# EAGLE schematic Adafruit Grand Central M4 Express rev B v7 (EAGLE 9.7.0)

## Sheet 1 of 2
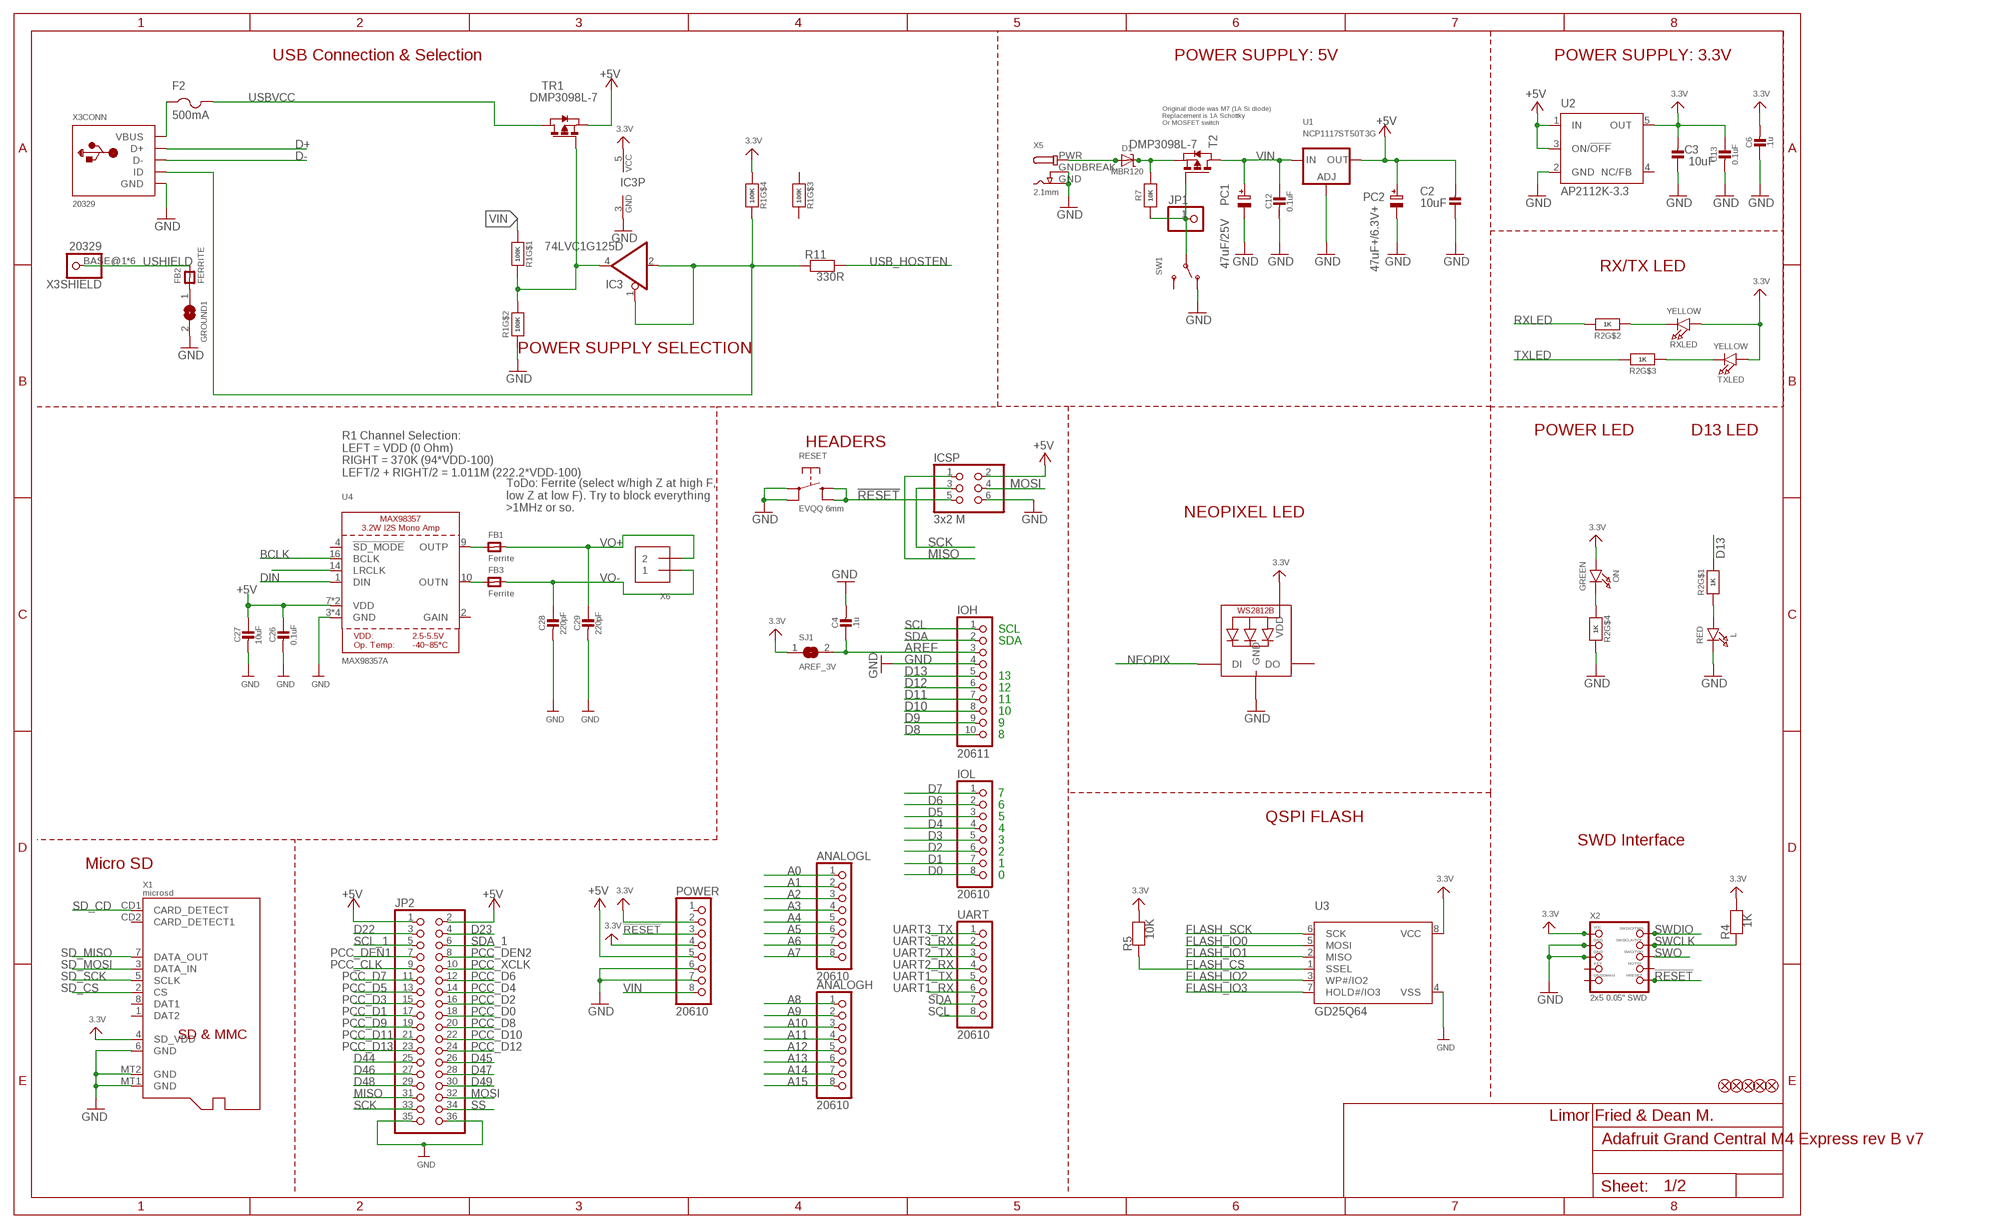
[diagram p0: schematic, sheet 1]

### Parts
ANALOGH  20610  HEADER-1X8OVALWAVE  [1X08_OVALWAVE]
ANALOGL  20610  HEADER-1X8OVALWAVE  [1X08_OVALWAVE]
C2  10uF  CAP_CERAMIC0805-NOOUTLINE  [0805-NO]
C3  10uF  CAP_CERAMIC0805-NOOUTLINE  [0805-NO]
C4  .1u  CAP_CERAMIC0603_NO  [0603-NO]
C6  .1u  CAP_CERAMIC0603_NO  [0603-NO]
C12  0.1uF  CAP_CERAMIC0603_NO  [0603-NO]
C13  0.1uF  CAP_CERAMIC0603_NO  [0603-NO]
C26  0.1uF  CAP_CERAMIC0805-NOOUTLINE  [0805-NO]
C27  10uF  CAP_CERAMIC0805-NOOUTLINE  [0805-NO]
C28  220pF  CAP_CERAMIC0805-NOOUTLINE  [0805-NO]
C29  220pF  CAP_CERAMIC0805-NOOUTLINE  [0805-NO]
D1  MBR120  DIODE-SCHOTTKYSOD-123  [SOD-123]
F2  500mA  PTCFUSE-1206  [R1206]
FB1  Ferrite  FERRITE-0805NO  [0805-NO]
FB2  FERRITE  FERRITE-0805NO  [0805-NO]
FB3  Ferrite  FERRITE-0805NO  [0805-NO]
FD1  FIDUCIAL_1MM  [FIDUCIAL_1MM]
FD2  FIDUCIAL_1MM  [FIDUCIAL_1MM]
FD3  FIDUCIAL_1MM  [FIDUCIAL_1MM]
FD4  FIDUCIAL_1MM  [FIDUCIAL_1MM]
FD5  FIDUCIAL_1MM  [FIDUCIAL_1MM]
GROUND1  SOLDERJUMPERCLOSED  [SOLDERJUMPER_CLOSEDWIRE]
IC3  74LVC1G125D  74AHC1G125DBV  [SOT23-5]
ICSP  3x2 M  HEADER-2X3  [2X03_ROUND_70MIL]
IOH  20611  HEADER-1X10OVALWAVE  [1X10_OVALWAVE]
IOL  20610  HEADER-1X8OVALWAVE  [1X08_OVALWAVE]
JP1  HEADER-1X1ROUND  [1X01_ROUND]
JP2  PINHD-2X18_THICKWAV  [2X18_THICKWAVE]
L  RED  LED0805_NOOUTLINE  [CHIPLED_0805_NOOUTLINE]
LED1  WS2812B3535  [LED3535]
ON  GREEN  LED0805_NOOUTLINE  [CHIPLED_0805_NOOUTLINE]
PC1  47uF/25V  CAP_ELECTROLYTICPANASONIC_D  [PANASONIC_D]
PC2  47uF+/6.3V+  CAP_ELECTROLYTICPANASONIC_D  [PANASONIC_D]
POWER  20610  HEADER-1X8OVALWAVE  [1X08_OVALWAVE]
R1  100K  RESISTOR_4PACK  [RESPACK_4X0603]
R2  1K  RESISTOR_4PACK  [RESPACK_4X0603]
R4  1K  RESISTOR_0603_NOOUT  [0603-NO]
R5  10K  RESISTOR_0603_NOOUT  [0603-NO]
R7  10K  RESISTOR_0603_NOOUT  [0603-NO]
R11  330R  RESISTOR_0603_NOOUT  [0603-NO]
RESET  EVQQ 6mm  SWITCH_TACT_SMT_EVQQ2_SMALL  [EVQ-Q2_SMALLER]
RXLED  YELLOW  LED0805_NOOUTLINE  [CHIPLED_0805_NOOUTLINE]
SJ1  AREF_3V  SOLDERJUMPERCLOSED  [SOLDERJUMPER_CLOSEDWIRE]
SW1  SWITCH_SPDT  [SPDT_SMT_SSSS811101]
T2  DMP3098L-7  PMOSSOT23  [SOT-23]
TR1  DMP3098L-7  0297_PMV48XP  [SOT-23]
TXLED  YELLOW  LED0805_NOOUTLINE  [CHIPLED_0805_NOOUTLINE]
U1  NCP1117ST50T3G  LM1117SOT223-REFLOW  [SOT223-R]
U2  AP2112K-3.3  LP2985-XXDBVR33  [SOT23-DBV]
U3  GD25Q64  SPIFLASH_SOIC8208MIL  [SOIC8_208MIL]
U4  MAX98357A  AUDIOAMP_MAX98357  [QFN16_3MM]
UART  20610  HEADER-1X8OVALWAVE  [1X08_OVALWAVE]
X1  microsd  MICROSD  [MICROSD]
X2  2x5 0.05" SWD  JTAG-CORTEXBOXPOSTS  [2X05_1.27MM_BOX_POSTS]
X3  20329  USB_W_SHIELD_V2  [4UCONN_20329_V2]
X5  2.1mm  DCBARRELPTH  [DCJACK_2MM_PTH]
X6  TERMBLOCK_1X2  [TERMBLOCK_1X2-3.5MM]

### Nets
3.3V: C3.2 C6.2 C13.1 IC3.5(VCC) LED1.2(VDD) ON.A POWER.2 POWER.4 R1.4 R4.2 R5.2 RXLED.A SJ1.1 TXLED.A U2.5(OUT) U3.8(VCC) X1.4(SD_VDD) X2.1(VCC) ; also sheet 2
!RESET: ICSP.5 POWER.3 RESET.B'(S1) RESET.B(S) X2.10(NRESET) ; also sheet 2
+5V [usbvcc]: C2.2 C26.1 C27.1 ICSP.2 JP2.1 JP2.2 PC2.+ POWER.5 TR1.2(S) U1.2(OUT) U1.4(OUT) U2.1(IN) U2.3(ON/!OFF) U4.7(VDD) U4.8(VDD)
A0: ANALOGL.1 ; also sheet 2
A1: ANALOGL.2 ; also sheet 2
A2: ANALOGL.3 ; also sheet 2
A3: ANALOGL.4 ; also sheet 2
A4: ANALOGL.5 ; also sheet 2
A5: ANALOGL.6 ; also sheet 2
A6: ANALOGL.7 ; also sheet 2
A7: ANALOGL.8 ; also sheet 2
A8: ANALOGH.1 ; also sheet 2
A9: ANALOGH.2 ; also sheet 2
A10: ANALOGH.3 ; also sheet 2
A11: ANALOGH.4 ; also sheet 2
A12: ANALOGH.5 ; also sheet 2
A13: ANALOGH.6 ; also sheet 2
A14: ANALOGH.7 ; also sheet 2
A15: ANALOGH.8 ; also sheet 2
AREF [aref]: C4.1 IOH.3 SJ1.2 ; also sheet 2
BCLK: U4.16(BCLK)
D0: IOL.8 ; also sheet 2
D1: IOL.7 ; also sheet 2
D2: IOL.6 ; also sheet 2
D3: IOL.5 ; also sheet 2
D4: IOL.4 ; also sheet 2
D5: IOL.3 ; also sheet 2
D6: IOL.2 ; also sheet 2
D7: IOL.1 ; also sheet 2
D8: IOH.10 ; also sheet 2
D9: IOH.9 ; also sheet 2
D10: IOH.8 ; also sheet 2
D11: IOH.7 ; also sheet 2
D12: IOH.6 ; also sheet 2
D13: IOH.5 R2.8 ; also sheet 2
D22: JP2.3 ; also sheet 2
D23: JP2.4 ; also sheet 2
D44: JP2.25 ; also sheet 2
D45: JP2.26 ; also sheet 2
D46: JP2.27 ; also sheet 2
D47: JP2.28 ; also sheet 2
D48: JP2.29 ; also sheet 2
D49: JP2.30 ; also sheet 2
D+ [USB]: X3.D+(CONN:D+) ; also sheet 2
D- [USB]: X3.D-(CONN:D-) ; also sheet 2
DIN: U4.1(DIN)
FLASH_CS: R5.1 U3.1(SSEL) ; also sheet 2
FLASH_IO0: U3.5(MOSI) ; also sheet 2
FLASH_IO1: U3.2(MISO) ; also sheet 2
FLASH_IO2: U3.3(WP#/IO2) ; also sheet 2
FLASH_IO3: U3.7(HOLD#/IO3) ; also sheet 2
FLASH_SCK: U3.6(SCK) ; also sheet 2
GND [gnd]: C2.1 C3.1 C4.2 C6.1 C12.2 C13.2 C26.2 C27.2 C28.2 C29.2 GROUND1.2 IC3.3(GND) ICSP.6 IOH.4 JP2.35 JP2.36 L.C LED1.4(GND) PC1.- PC2.- POWER.6 POWER.7 R1.2 R2.5 RESET.A'(P1) RESET.A(P) SW1.A(O) U1.1(ADJ) U2.2(GND) U3.4(VSS) U4.3(GND) U4.11(GND) U4.15(GND) U4.THERMAL(GND) X1.6(GND) X1.MT1(GND) X1.MT2(GND) X2.3(GND) X2.5(GND) X3.GND(CONN:GND) X5.GND X5.GNDBREAK ; also sheet 2
MISO: ICSP.1 JP2.31 ; also sheet 2
MOSI: ICSP.4 JP2.32 ; also sheet 2
N$1: L.A R2.1
N$2: FB2.1 GROUND1.1
N$3: ON.C R2.4
N$5: R2.2 RXLED.C
N$6: FB3.1 U4.10(OUTN)
N$7: R2.3 TXLED.C
N$8: FB1.1 U4.9(OUTP)
N$10: IC3.1(OE) IC3.2(I) R1.5 R11.1 X3.ID(CONN:ID)
N$11: IC3.4(O) R1.7 R1.8 TR1.3(G)
N$13: U4.14(LRCLK)
N$15: D1.C R7.2 T2.2(S)
NEOPIX: LED1.1(DI) ; also sheet 2
PCC_CLK: JP2.9 ; also sheet 2
PCC_D0: JP2.18 ; also sheet 2
PCC_D1: JP2.17 ; also sheet 2
PCC_D2: JP2.16 ; also sheet 2
PCC_D3: JP2.15 ; also sheet 2
PCC_D4: JP2.14 ; also sheet 2
PCC_D5: JP2.13 ; also sheet 2
PCC_D6: JP2.12 ; also sheet 2
PCC_D7: JP2.11 ; also sheet 2
PCC_D8: JP2.20 ; also sheet 2
PCC_D9: JP2.19 ; also sheet 2
PCC_D10: JP2.22 ; also sheet 2
PCC_D11: JP2.21 ; also sheet 2
PCC_D12: JP2.24 ; also sheet 2
PCC_D13: JP2.23 ; also sheet 2
PCC_DEN1: JP2.7 ; also sheet 2
PCC_DEN2: JP2.8 ; also sheet 2
PCC_XCLK: JP2.10 ; also sheet 2
PWR_SWITCH: JP1.1 R7.1 SW1.B(P) T2.3(G)
PWRIN [USB]: D1.A X5.PWR
RXLED: R2.7 ; also sheet 2
SCK: ICSP.3 JP2.33 ; also sheet 2
SCL: IOH.1 UART.8 ; also sheet 2
SCL_1: JP2.5 ; also sheet 2
SD_CD: X1.CD1(CARD_DETECT) ; also sheet 2
SD_CS: X1.2(CS) ; also sheet 2
SD_MISO: X1.7(DATA_OUT) ; also sheet 2
SD_MOSI: X1.3(DATA_IN) ; also sheet 2
SD_SCK: X1.5(SCLK) ; also sheet 2
SDA: IOH.2 UART.7 ; also sheet 2
SDA_1: JP2.6 ; also sheet 2
SS: JP2.34 ; also sheet 2
SWCLK: R4.1 X2.4(SWDCLK) ; also sheet 2
SWDIO: X2.2(SWDIO) ; also sheet 2
SWO: X2.6(SWO) ; also sheet 2
TXLED: R2.6 ; also sheet 2
UART1_RX: UART.6 ; also sheet 2
UART1_TX: UART.5 ; also sheet 2
UART2_RX: UART.4 ; also sheet 2
UART2_TX: UART.3 ; also sheet 2
UART3_RX: UART.2 ; also sheet 2
UART3_TX: UART.1 ; also sheet 2
USB_HOSTEN: R11.2 ; also sheet 2
USBVCC [usbvcc]: F2.2 TR1.1(D)
USHIELD [gnd]: FB2.2 X3.BASE@1 X3.BASE@2 X3.SPRT@1 X3.SPRT@2 X3.SPRT@3 X3.SPRT@4
VBUS: F2.1 X3.VBUS(CONN:VBUS)
VIN [USB]: C12.1 PC1.+ POWER.8 R1.1 T2.1(D) U1.3(IN)
VO+: C29.1 FB1.2 X6.2
VO-: C28.1 FB3.2 X6.1
Unconnected: LED1.3(DO) POWER.1 R1.3 R1.6 SW1.C(S) U2.4(NC/FB) U4.2(GAIN) U4.4(!SD_MODE) X1.1(DAT2) X1.8(DAT1) X1.CD2(CARD_DETECT1) X2.7(KEY) X2.8(TDI) X2.9(GNDDETECT)

### Notes on the sheet
- USB Connection & Selection | POWER SUPPLY: 5V | POWER SUPPLY: 3.3V
- Original diode was M7 (1A Si diode)
  Replacement is 1A Schottky
  Or MOSFET switch
- RX/TX LED
- POWER SUPPLY SELECTION
- POWER LED | D13 LED
- HEADERS
- R1 Channel Selection:
  LEFT = VDD (0 Ohm)
  RIGHT = 370K (94*VDD-100)
  LEFT/2 + RIGHT/2 = 1.011M (222.2*VDD-100)
- ToDo: Ferrite (select w/high Z at high F,
  low Z at low F). Try to block everything
  >1MHz or so.
- NEOPIXEL LED
- SCL
- SDA
- 13
- 12
- 11
- 10
- 9
- 8
- 7
- 6
- 5 | QSPI FLASH
- 4
- 3 | SWD Interface
- 2
- Micro SD | 1
- 0
- Limor Fried & Dean M.

## Sheet 2 of 2
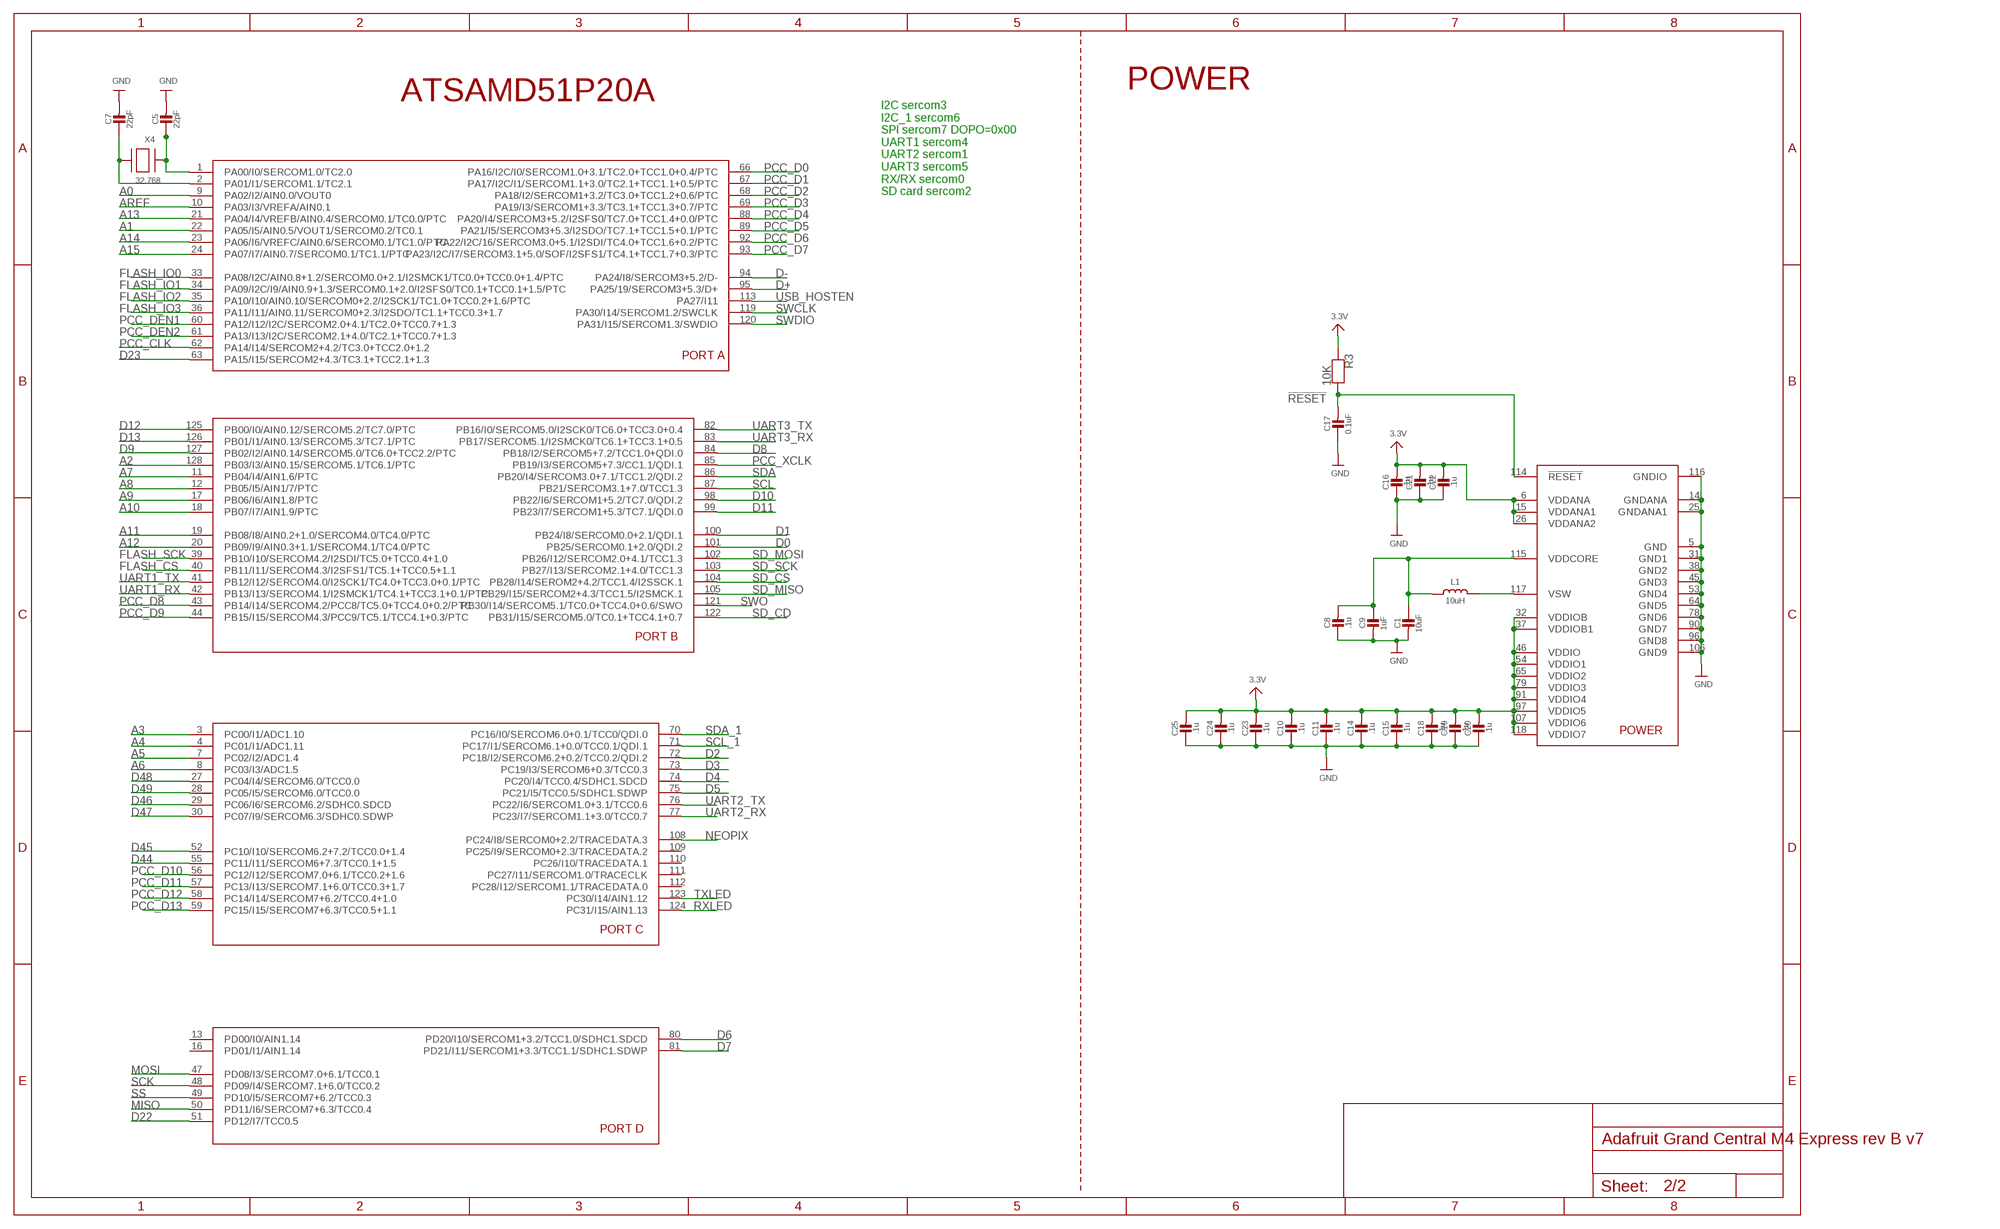
[diagram p1: schematic, sheet 2]

### Parts
C1  10uF  CAP_CERAMIC0805-NOOUTLINE  [0805-NO]
C5  22pF  CAP_CERAMIC0603_NO  [0603-NO]
C7  22pF  CAP_CERAMIC0603_NO  [0603-NO]
C8  .1u  CAP_CERAMIC0603_NO  [0603-NO]
C9  1uF  CAP_CERAMIC0603_NO  [0603-NO]
C10  .1u  CAP_CERAMIC0603_NO  [0603-NO]
C11  .1u  CAP_CERAMIC0603_NO  [0603-NO]
C14  .1u  CAP_CERAMIC0603_NO  [0603-NO]
C15  .1u  CAP_CERAMIC0603_NO  [0603-NO]
C16  .1u  CAP_CERAMIC0603_NO  [0603-NO]
C17  0.1uF  CAP_CERAMIC0603_NO  [0603-NO]
C18  .1u  CAP_CERAMIC0603_NO  [0603-NO]
C19  .1u  CAP_CERAMIC0603_NO  [0603-NO]
C20  .1u  CAP_CERAMIC0603_NO  [0603-NO]
C21  .1u  CAP_CERAMIC0603_NO  [0603-NO]
C22  .1u  CAP_CERAMIC0603_NO  [0603-NO]
C23  .1u  CAP_CERAMIC0603_NO  [0603-NO]
C24  .1u  CAP_CERAMIC0603_NO  [0603-NO]
C25  .1u  CAP_CERAMIC0603_NO  [0603-NO]
L1  10uH  INDUCTOR  [INDUCTOR_1007]
R3  10K  RESISTOR_0603_NOOUT  [0603-NO]
U$1  SAMD51PXXA  [SQFP-S-14X14-128]
X4  32.768  XTAL-3.2X1.5  [XTAL3215]

### Nets
3.3V: C10.2 C11.2 C14.2 C15.2 C16.2 C18.2 C19.2 C20.2 C21.2 C22.2 C23.2 C24.2 C25.2 R3.1 U$1.6(VDDANA) U$1.15(VDDANA1) U$1.26(VDDANA2) U$1.32(VDDIOB) U$1.37(VDDIOB1) U$1.46(VDDIO) U$1.54(VDDIO1) U$1.65(VDDIO2) U$1.79(VDDIO3) U$1.91(VDDIO4) U$1.97(VDDIO5) U$1.107(VDDIO6) U$1.118(VDDIO7) ; also sheet 1
!RESET: C17.2 R3.2 U$1.114(!RESET) ; also sheet 1
A0: U$1.9(PA02/I2/AIN0.0/VOUT0) ; also sheet 1
A1: U$1.22(PA05/I5/AIN0.5/VOUT1/SERCOM0.2/TC0.1) ; also sheet 1
A2: U$1.128(PB03/I3/AIN0.15/SERCOM5.1/TC6.1/PTC) ; also sheet 1
A3: U$1.3(PC00/I1/ADC1.10) ; also sheet 1
A4: U$1.4(PC01/I1/ADC1.11) ; also sheet 1
A5: U$1.7(PC02/I2/ADC1.4) ; also sheet 1
A6: U$1.8(PC03/I3/ADC1.5) ; also sheet 1
A7: U$1.11(PB04/I4/AIN1.6/PTC) ; also sheet 1
A8: U$1.12(PB05/I5/AIN1/7/PTC) ; also sheet 1
A9: U$1.17(PB06/I6/AIN1.8/PTC) ; also sheet 1
A10: U$1.18(PB07/I7/AIN1.9/PTC) ; also sheet 1
A11: U$1.19(PB08/I8/AIN0.2+1.0/SERCOM4.0/TC4.0/PTC) ; also sheet 1
A12: U$1.20(PB09/I9/AIN0.3+1.1/SERCOM4.1/TC4.0/PTC) ; also sheet 1
A13: U$1.21(PA04/I4/VREFB/AIN0.4/SERCOM0.1/TC0.0/PTC) ; also sheet 1
A14: U$1.23(PA06/I6/VREFC/AIN0.6/SERCOM0.1/TC1.0/PTC) ; also sheet 1
A15: U$1.24(PA07/I7/AIN0.7/SERCOM0.1/TC1.1/PTC) ; also sheet 1
AREF [aref]: U$1.10(PA03/I3/VREFA/AIN0.1) ; also sheet 1
D0: U$1.101(PB25/SERCOM0.1+2.0/QDI.2) ; also sheet 1
D1: U$1.100(PB24/I8/SERCOM0.0+2.1/QDI.1) ; also sheet 1
D2: U$1.72(PC18/I2/SERCOM6.2+0.2/TCC0.2/QDI.2) ; also sheet 1
D3: U$1.73(PC19/I3/SERCOM6+0.3/TCC0.3) ; also sheet 1
D4: U$1.74(PC20/I4/TCC0.4/SDHC1.SDCD) ; also sheet 1
D5: U$1.75(PC21/I5/TCC0.5/SDHC1.SDWP) ; also sheet 1
D6: U$1.80(PD20/I10/SERCOM1+3.2/TCC1.0/SDHC1.SDCD) ; also sheet 1
D7: U$1.81(PD21/I11/SERCOM1+3.3/TCC1.1/SDHC1.SDWP) ; also sheet 1
D8: U$1.84(PB18/I2/SERCOM5+7.2/TCC1.0+QDI.0) ; also sheet 1
D9: U$1.127(PB02/I2/AIN0.14/SERCOM5.0/TC6.0+TCC2.2/PTC) ; also sheet 1
D10: U$1.98(PB22/I6/SERCOM1+5.2/TC7.0/QDI.2) ; also sheet 1
D11: U$1.99(PB23/I7/SERCOM1+5.3/TC7.1/QDI.0) ; also sheet 1
D12: U$1.125(PB00/I0/AIN0.12/SERCOM5.2/TC7.0/PTC) ; also sheet 1
D13: U$1.126(PB01/I1/AIN0.13/SERCOM5.3/TC7.1/PTC) ; also sheet 1
D22: U$1.51(PD12/I7/TCC0.5) ; also sheet 1
D23: U$1.63(PA15/I15/SERCOM2+4.3/TC3.1+TCC2.1+1.3) ; also sheet 1
D44: U$1.55(PC11/I11/SERCOM6+7.3/TCC0.1+1.5) ; also sheet 1
D45: U$1.52(PC10/I10/SERCOM6.2+7.2/TCC0.0+1.4) ; also sheet 1
D46: U$1.29(PC06/I6/SERCOM6.2/SDHC0.SDCD) ; also sheet 1
D47: U$1.30(PC07/I9/SERCOM6.3/SDHC0.SDWP) ; also sheet 1
D48: U$1.27(PC04/I4/SERCOM6.0/TCC0.0) ; also sheet 1
D49: U$1.28(PC05/I5/SERCOM6.0/TCC0.0) ; also sheet 1
D+ [USB]: U$1.95(PA25/19/SERCOM3+5.3/D+) ; also sheet 1
D- [USB]: U$1.94(PA24/I8/SERCOM3+5.2/D-) ; also sheet 1
FLASH_CS: U$1.40(PB11/I11/SERCOM4.3/I2SFS1/TC5.1+TCC0.5+1.1) ; also sheet 1
FLASH_IO0: U$1.33(PA08/I2C/AIN0.8+1.2/SERCOM0.0+2.1/I2SMCK1/TC0.0+TCC0.0+1.4/PTC) ; also sheet 1
FLASH_IO1: U$1.34(PA09/I2C/I9/AIN0.9+1.3/SERCOM0.1+2.0/I2SFS0/TC0.1+TCC0.1+1.5/PTC) ; also sheet 1
FLASH_IO2: U$1.35(PA10/I10/AIN0.10/SERCOM0+2.2/I2SCK1/TC1.0+TCC0.2+1.6/PTC) ; also sheet 1
FLASH_IO3: U$1.36(PA11/I11/AIN0.11/SERCOM0+2.3/I2SDO/TC1.1+TCC0.3+1.7) ; also sheet 1
FLASH_SCK: U$1.39(PB10/I10/SERCOM4.2/I2SDI/TC5.0+TCC0.4+1.0) ; also sheet 1
GND [gnd]: C1.2 C5.2 C7.2 C8.1 C9.2 C10.1 C11.1 C14.1 C15.1 C16.1 C17.1 C18.1 C19.1 C20.1 C21.1 C22.1 C23.1 C24.1 C25.1 U$1.5(GND) U$1.14(GNDANA) U$1.25(GNDANA1) U$1.31(GND1) U$1.38(GND2) U$1.45(GND3) U$1.53(GND4) U$1.64(GND5) U$1.78(GND6) U$1.90(GND7) U$1.96(GND8) U$1.106(GND9) U$1.116(GNDIO) ; also sheet 1
MISO: U$1.50(PD11/I6/SERCOM7+6.3/TCC0.4) ; also sheet 1
MOSI: U$1.47(PD08/I3/SERCOM7.0+6.1/TCC0.1) ; also sheet 1
N$4: L1.P$2 U$1.117(VSW)
N$9: C5.1 U$1.1(PA00/I0/SERCOM1.0/TC2.0) X4.P$1
N$12: C7.1 U$1.2(PA01/I1/SERCOM1.1/TC2.1) X4.P$2
NEOPIX: U$1.108(PC24/I8/SERCOM0+2.2/TRACEDATA.3) ; also sheet 1
PCC_CLK: U$1.62(PA14/I14/SERCOM2+4.2/TC3.0+TCC2.0+1.2) ; also sheet 1
PCC_D0: U$1.66(PA16/I2C/I0/SERCOM1.0+3.1/TC2.0+TCC1.0+0.4/PTC) ; also sheet 1
PCC_D1: U$1.67(PA17/I2C/I1/SERCOM1.1+3.0/TC2.1+TCC1.1+0.5/PTC) ; also sheet 1
PCC_D2: U$1.68(PA18/I2/SERCOM1+3.2/TC3.0+TCC1.2+0.6/PTC) ; also sheet 1
PCC_D3: U$1.69(PA19/I3/SERCOM1+3.3/TC3.1+TCC1.3+0.7/PTC) ; also sheet 1
PCC_D4: U$1.88(PA20/I4/SERCOM3+5.2/I2SFS0/TC7.0+TCC1.4+0.0/PTC) ; also sheet 1
PCC_D5: U$1.89(PA21/I5/SERCOM3+5.3/I2SDO/TC7.1+TCC1.5+0.1/PTC) ; also sheet 1
PCC_D6: U$1.92(PA22/I2C/16/SERCOM3.0+5.1/I2SDI/TC4.0+TCC1.6+0.2/PTC) ; also sheet 1
PCC_D7: U$1.93(PA23/I2C/I7/SERCOM3.1+5.0/SOF/I2SFS1/TC4.1+TCC1.7+0.3/PTC) ; also sheet 1
PCC_D8: U$1.43(PB14/I14/SERCOM4.2/PCC8/TC5.0+TCC4.0+0.2/PTC) ; also sheet 1
PCC_D9: U$1.44(PB15/I15/SERCOM4.3/PCC9/TC5.1/TCC4.1+0.3/PTC) ; also sheet 1
PCC_D10: U$1.56(PC12/I12/SERCOM7.0+6.1/TCC0.2+1.6) ; also sheet 1
PCC_D11: U$1.57(PC13/I13/SERCOM7.1+6.0/TCC0.3+1.7) ; also sheet 1
PCC_D12: U$1.58(PC14/I14/SERCOM7+6.2/TCC0.4+1.0) ; also sheet 1
PCC_D13: U$1.59(PC15/I15/SERCOM7+6.3/TCC0.5+1.1) ; also sheet 1
PCC_DEN1: U$1.60(PA12/I12/I2C/SERCOM2.0+4.1/TC2.0+TCC0.7+1.3) ; also sheet 1
PCC_DEN2: U$1.61(PA13/I13/I2C/SERCOM2.1+4.0/TC2.1+TCC0.7+1.3) ; also sheet 1
PCC_XCLK: U$1.85(PB19/I3/SERCOM5+7.3/CC1.1/QDI.1) ; also sheet 1
RXLED: U$1.124(PC31/I15/AIN1.13) ; also sheet 1
SCK: U$1.48(PD09/I4/SERCOM7.1+6.0/TCC0.2) ; also sheet 1
SCL: U$1.87(PB21/SERCOM3.1+7.0/TCC1.3) ; also sheet 1
SCL_1: U$1.71(PC17/I1/SERCOM6.1+0.0/TCC0.1/QDI.1) ; also sheet 1
SD_CD: U$1.122(PB31/I15/SERCOM5.0/TC0.1+TCC4.1+0.7) ; also sheet 1
SD_CS: U$1.104(PB28/I14/SEROM2+4.2/TCC1.4/I2SSCK.1) ; also sheet 1
SD_MISO: U$1.105(PB29/I15/SERCOM2+4.3/TCC1.5/I2SMCK.1) ; also sheet 1
SD_MOSI: U$1.102(PB26/I12/SERCOM2.0+4.1/TCC1.3) ; also sheet 1
SD_SCK: U$1.103(PB27/I13/SERCOM2.1+4.0/TCC1.3) ; also sheet 1
SDA: U$1.86(PB20/I4/SERCOM3.0+7.1/TCC1.2/QDI.2) ; also sheet 1
SDA_1: U$1.70(PC16/I0/SERCOM6.0+0.1/TCC0/QDI.0) ; also sheet 1
SS: U$1.49(PD10/I5/SERCOM7+6.2/TCC0.3) ; also sheet 1
SWCLK: U$1.119(PA30/I14/SERCOM1.2/SWCLK) ; also sheet 1
SWDIO: U$1.120(PA31/I15/SERCOM1.3/SWDIO) ; also sheet 1
SWO: U$1.121(PB30/I14/SERCOM5.1/TC0.0+TCC4.0+0.6/SWO) ; also sheet 1
TXLED: U$1.123(PC30/I14/AIN1.12) ; also sheet 1
UART1_RX: U$1.42(PB13/I13/SERCOM4.1/I2SMCK1/TC4.1+TCC3.1+0.1/PTC) ; also sheet 1
UART1_TX: U$1.41(PB12/I12/SERCOM4.0/I2SCK1/TC4.0+TCC3.0+0.1/PTC) ; also sheet 1
UART2_RX: U$1.77(PC23/I7/SERCOM1.1+3.0/TCC0.7) ; also sheet 1
UART2_TX: U$1.76(PC22/I6/SERCOM1.0+3.1/TCC0.6) ; also sheet 1
UART3_RX: U$1.83(PB17/SERCOM5.1/I2SMCK0/TC6.1+TCC3.1+0.5) ; also sheet 1
UART3_TX: U$1.82(PB16/I0/SERCOM5.0/I2SCK0/TC6.0+TCC3.0+0.4) ; also sheet 1
USB_HOSTEN: U$1.113(PA27/I11) ; also sheet 1
VDDCORE: C1.1 C8.2 C9.1 L1.P$1 U$1.115(VDDCORE)
Unconnected: U$1.13(PD00/I0/AIN1.14) U$1.16(PD01/I1/AIN1.14) U$1.109(PC25/I9/SERCOM0+2.3/TRACEDATA.2) U$1.110(PC26/I10/TRACEDATA.1) U$1.111(PC27/I11/SERCOM1.0/TRACECLK) U$1.112(PC28/I12/SERCOM1.1/TRACEDATA.0)

### Notes on the sheet
- POWER
- ATSAMD51P20A
- I2C sercom3
  I2C_1 sercom6
  SPI sercom7 DOPO=0x00
  UART1 sercom4
  UART2 sercom1
  UART3 sercom5
  RX/RX sercom0
  SD card sercom2

## Library data of the parts
ANALOGH ANALOGL IOL POWER UART = microbuilder:HEADER-1X8: PIN HEADER
C1-C29 = microbuilder:CAP_CERAMIC: Ceramic Capacitors For new designs, use the packages preceded by an '_' character since they are more reliable: The following footprints should be used on most boards: _0402 - Standard footprint for regular board layouts _0603 - Standard footprint for regular board layouts _0805 - Standard footprint for regular board layouts _1206 - Standard footprint for regular board layouts For extremely tight-pitch boards where space is at a premium, the following 'micro-pitch' footprints can be used (smaller pads, no silkscreen outline, etc.): _0402MP - Micro-pitch footprint for very dense/compact boards _0603MP - Micro-pitch footprint for very dense/compact boards _0805MP - Micro-pitch footprint for very dense/compact boards _1206MP - Micro-pitch footprint for very dense/compact boards
D1 = microbuilder:DIODE-SCHOTTKY
F2 = adafruit:PTCFUSE: PTC fuses, resettable thermistors
FB1-FB3 = microbuilder:FERRITE: Ferrite Bead 0603 MMZ1608B121C - 120 Ohm @ 100MHz, 600mA, 0.15 Ohm DC Resistance - Digikey: 445-2164-1-ND BK1608HW121-T - 120 Ohm, 600mA Ferrite Chip - Digikey: 587-1876-2-ND 0805 HZ0805B272R-10 - 2.7K Ohm @ 100MHz, 200mA, 0.8 Ohm DC Resistance - Digikey: 240-2504-1-ND (see also Murata BLM21BD272SN1L) MMZ2012Y152B - 1.5K Ohm @ 100MHz, 500mA, 0.4 Ohm DC Resistance - Digikey: 445-1560-1-ND - Mainly for high frequency (80-400MHz) MMZ2012R102A - 1K Ohm @ 100MHz, 500mA, 0.3 Ohm DC Resistance - Digikey: 445-1555-2-ND - More general purpose (10-200MHz)
FD1-FD5 = microbuilder:FIDUCIAL: Fiducial Alignment Points Various fiducial points for machine vision alignment.; BOM: EXCLUDE
GROUND1 SJ1 = microbuilder:SOLDERJUMPER: SMD Solder JUMPER Solder the two pads together to create a connection, or remove the solder to break it. REFLOW - Use this footprint for solder paste and reflow ovens. WAVE - Use this footprint for hand-soldering (larger pads). CLOSED - Has a trace between the two pads to ensure it is closed by default. The trace needs to be cut to disable the jumper, and can be closed again by creating a solder bridge between the two pads.
IC3 = 74xx-little-de:74*1G125: Single Bus Buffer Gate with 3-State Output
ICSP = microbuilder:HEADER-2X3: PIN HEADER
IOH = microbuilder:HEADER-1X10: PIN HEADER
JP1 = microbuilder:HEADER-1X1: PIN HEADER
JP2 = microbuilder:PINHD-2X18: PIN HEADER
L ON RXLED TXLED = microbuilder:LED: LED 0603 - 0603 Surface Mount Package 2mA: Green LED - Low Power (3.9mcd, 2ma, 1.7Vf) - Digikey: 475-2709-2-ND Orange LED - Low Power (9.8mcd, 2ma, 1.8Vf) - Digikey: 475-1194-2-ND Red LED - Low Power (5mcd, 2ma, 1.8Vf) - Digikey: 475-1195-2-ND Yellow LED - Low Power (7mcd, 2ma, 1.8Vf) - Digikey: 475-1196-2-ND 5mA: Blue LED - Low Power (17mcd, 5ma, 2.9Vf) - Digikey: LNJ937W8CRACT-ND 0805 - 0805 Surface Mount Package 2mA: Red LED (8.8mcd, 2mA, 1.8Vf, Clear) - Low Power [Digikey: 475-2510-1-ND] Green LED (5mcd, 2mA, 1.8Vf, Clear) - Low Power [Digikey: 475-2730-1-ND] Yellow LED (11.3mcd, 2mA, 1.8Vf, Clear) - Low Power [Digikey: 475-2555-1-ND] 20mA: Red LED (104mcd, 20mA, Diffused) - LS R976 [Digikey: 475-1278-6-ND] Red LED (12mcd, 20mA, 2.0Vf, Clear) - APT2012EC [Digikey: 754-1128-1-ND] Green LED (15mcd, 20mA, 2.2Vf, Clear) - APT2012GC [Digikey: 754-1131-1-ND] Orange LED (160mcd, 20mA, 2.1Vf, Clear) - APT2012SECK [Digikey: 754-1130-1-ND] 1206 - 1206 Surface Mount Package Green LED (26mcd, 20mA, Diffused) - LG N971 [Digikey: 475-1407-6-ND] Red LED (15mcd, 20mA, Diffused) - LH N974 [Digikey: 475-1416-6-ND] Cree - Cree High-Power Surface Mount LEDs XPEBWT-L1-0000-00D50 - White 111lm 350mA 2.9Vf 6200K 110° XTEAWT-00-0000-00000LEE3 - White 114lm 350mA 2.85Vf 5000K 115° Everlight - Everlight 45-21 Series Surface Mount LEDs 45-21/QK2C-B2832AC2CB2/2T - Warm White 2000mcd 20mA 3.25Vf 3050K 120° 45-21/LK2C-B38452C4CB2/2T - Nuetral White 2000mcd 20mA 3.25Vf 4150K 120° 45-21/LK2C-B50634C6CB2/2T - Cold White 2200mcd 20mA 3.25Vf 5650K 120° PLCC2 Reverse Mount LS T77K-J1L2-1-0-2-R18-Z - Red 11.25mcd 2mA 1.8Vf 630nm 120° LO T77K-L1M2-24-Z - Orange 19.6mcd 2mA 1.8Vf 606nm 120° LY T77K-K2M1-26-Z - Yellow 15.7mcd 2mA 1.8Vf 587nm 120°
L1 = microbuilder:INDUCTOR: Inductors 0603: 10nH Ceramic Inductor - microwire antenna/RF (Digikey: 712-1434-2-ND) 0805: 560nH Ceramic Inductor - RF (Digikey: 553-1047-1-ND) 270nH Ceramic Inductor - Q = 40@250MHz, +-5%, 1 Ohm DC Resistance (Digikey: 535-10506-2-ND) 1007 (2518 Metric) SMT: 10µH 10% 250mOhm 820mA 1007 Inductor (Digikey: 587-2189-1-ND) 22µH 10% 500mOhm 580mA 1007 Inductor (Digikey: 587-2190-1-ND) 47µH 10% 950mOhm 420mA 1007 Inductor (Digikey: 587-2191-1-ND) 47µH 5% 100mOhm 1A 1008 Inductor (Digikey: 732-1816-1-ND) 5.0x5.0mm (Taiyo Yuden NR5040 Series) 6.8µH 20% 2.3A 64mOhm Inductor (Digikey: 587-2374-2-ND) 5.0x5.0mm (TDK VLC5045 Series) 4.7µH 20% 3.3A 34mOhm Inductor (Digikey: 445-6526-1-ND) 6.8µH 20% 2.7A 46mOhm Inductor (Digikey: 445-6527-1-ND) 6.0x6.0mm (TDK VLC6045 Series) 4.7µH 20% 3.8A 27mOhm Inductor (Digikey: 445-6538-2-ND) 6.8µH 20% 3A 41mOhm Inductor (Digikey: 445-6540-1-ND) 6.2µH 30% 2.2A 45mOhm Inductor (Digikey: SRR5028-6R2YCT-ND) - Not TDK VLC6045 but footprint should match 6.0x6.0mm (TDK SLF6045 Series) 6.8uH 30% 2A 33mOhm Inductor (Digikey: 445-4572-1-ND, Mouser: 810-SLF645T6R8N2R0PF) 6.0x6.0mm (Sumida CDRH5D28 Series) 6.2uH 30% 1.8A 45mOhm Inductor (Digikey: 308-1542-1-ND) Taiyo Yuden NR3015T2R2M - 2.2uH 20% 1.5A (Digikey: 587-1648-2-ND, Mouser: 963-NR3015T2R2M) - Used with TI TPS62172 CoilCraft RFID Transponder Coil - MA5532-AE (For use with AS3935 Lightning Sensor) Taiyo Yuden NRH2412T2R2MNGH - 2.2uH 20% 1AA (Digikey: 587-3443-1-ND) - Used with TI LM3671 Vishay IHLP 1.0uH Molded Inductor - 24mOhm DCR, 5A, +/-20%, -55°C-125°C (Digikey: 541-1319-1-ND)
LED1 = microbuilder:WS2812B
PC1 PC2 = microbuilder:CAP_ELECTROLYTIC: Electrolytic Capacitors SMT PANASONIC_C - Size C Panasonic Electrolytic Aluminum Capacitor 47µF 16V 20% Electrolytic Capacitor [Digikey: PCE3890TR-ND] PANASONIC_D - Size D Panasonic Electrolytic Aluminum Capacitor 100µF 25V 20% Electrolytic Capacitor [Digikey: PCE3898TR-ND] PTH 3.5 mm grid, 8 mm diameter ... 3.5 mm grid, 10 mm diameter ...
R1 R2 = microbuilder:RESISTOR_4PACK: Resistor Packs (4 resistors) 4 x 0603 10K 1/16W - Digikey: YC164J-10KCT-ND
R3-R5 R7 R11 = microbuilder:RESISTOR: Resistors For new designs, use the packages preceded by an '_' character since they are more reliable: The following footprints should be used on most boards: _0402 - Standard footprint for regular board layouts _0603 - Standard footprint for regular board layouts _0805 - Standard footprint for regular board layouts _1206 - Standard footprint for regular board layouts For extremely tight-pitch boards where space is at a premium, the following 'micro-pitch' footprints can be used (smaller pads, no silkscreen outline, etc.): _0402MP - Micro-pitch footprint for very dense/compact boards _0603MP - Micro-pitch footprint for very dense/compact boards _0805MP - Micro-pitch footprint for very dense/compact boards _1206MP - Micro-pitch footprint for very dense/compact boards
RESET = microbuilder:SWITCH_TACT_SMT: SMT Tact Switches 6x6mm - Digikey: P12940SCT-ND KMR2 (4.6x2.8mm) - Digikey: 401-1426-1-ND EVQ-PQHB55 - Light Touch, 160GF (4.5x4.5mm) - Digikey: P8090SCT-ND KMT0 - KMT021 NGJ LHS (etc.) IP68/Waterproof - Digikey: CKN10289CT-ND
SW1 = microbuilder:SWITCH_SPDT: Switch - SPDT SSSS811101 - Horizontal Two Position SMT, 0.3A 4V [Mouser: 688-SSSS811101]
T2 = zetex:PMOSSOT23: MOS FET; OC_FARNELL: unknown; OC_NEWARK: unknown
TR1 = Transistors:0297_PMV48XP: 20 V, 3.5 A P-channel Trench MOSFET - PMV48XP; CASE: SOT23; MONTHLY_USAGE: _____; PART_NUMBER: PMV48XP; PRICE: _____; SUPPLIER: _____; TYPE: Transistor; VALUE: PMV48XP
U1 = microbuilder:LM1117: LM1117 Voltage Regulator LM1117 Adjustable Voltage regulator [Digikey: LM1117IMP-ADJDKR-ND] LM1117 3.3V Voltage regulator [AP1117E33GDIDKR-ND] LM1117 5.0V Voltage regulator [AP1117E50GDIDKR-ND] SOT223-REFLOW - SOT223 package for solder paste/reflow ovens SOT223-WAVE - SOT223 package for hand-soldering (larger pads) Note: For the fixed-voltage regulators, simply set the ADJ pin to GND.
U2 = SmartPrj:LP2985-XXDBVR: ULTRALOW-POWER 50-mA LOW-DROPOUT LINEAR REGULATORS 50-mA Low-Dropout Regulator Source: http://focus.ti.com/lit/ds/symlink/tps77001.pdf
U3 = microbuilder:SPIFLASH_SOIC8: SOIC8 SPI Flash Be careful with the size since SOIC8 flash comes in several 'widths' SOIC8 150 mil M25P16 - 16Mbit (2Mbit x 8) Serial Flash (75MHz SPI Bus), Supply: 2.7-3.6V Digikey: SOIC8 - M25P16-VMN6P-ND SOIC8 208 mil W25Q16BVSSIG - 16Mbit (2Mbit x 8) Serial Flash (104MHz SPI Bus), Supply: 2.7-3.6V Digikey: SOIC8 - W25Q16BVSSIG-ND
U4 = microbuilder:AUDIOAMP_MAX98357: MAX98357 - 3.2W I2S Mono Audio Amp
U$1 = microbuilder:SAMD51PXXA: SAMD51 P variant
X1 = microbuilder:MICROSD: MicroSD/Transflash Card Holder with SPI pinout 3M: 2908-05WB-MG 4UConnector: 19656 Footprint courtesy: Adafruit Industries
X2 = microbuilder:JTAG-CORTEX: Serial Wire (SW-DP) Connector Standard 0.05" 10-pin connector is for use with the Cortex M and Cortex A SWD (serial wire debugger) interface (SW-DP) Connectors 2x05_1.27MM_SMT - Inexpensive surface-mount header with bare pins, compatible with standard 10-pin SWD cables (4UCON: 16846) 2x05_1.27MM_BOX_NOPOSTS - Polarised surface-mount box (4UCON with caps: 19735, without caps: 15117 2x05_1.27MM_BOX_POSTS - Polarised surface-mount box with mounting holes (4UCON: 20317) Pinout: http://infocenter.arm.com/help/topic/com.arm.doc.faqs/attached/13634/cortex_debug_connectors.pdf http://www.keil.com/peripherals/coresight/connectors.asp
X3 = microbuilder:USB_W_SHIELD
X4 = adafruit2:XTAL: Low cost SMT crystals, no capacitors included http://www.ladyada.net/library/eagle
X5 = microbuilder:DCBARREL: DC Barrel Jack DCJACK_1.3MM_PTH - Through Hole 1.3mm Jack (4UConnector: 05536) DCJACK_2MM_PTH - Through Hole 2.0/2.1 Jack (4UConnector: 05537) DCJACK_2MM_SMT - SMT 2.0/2.1mm Jack(4UConnector: 03267)
X6 = microbuilder:TERMBLOCK_1X2: 3.5mm Terminal block http://www.ladyada.net/library/pcb/eaglelibrary.html